# EAGLE design Accumulator Indicator Light r2 (EAGLE 7.2.0)
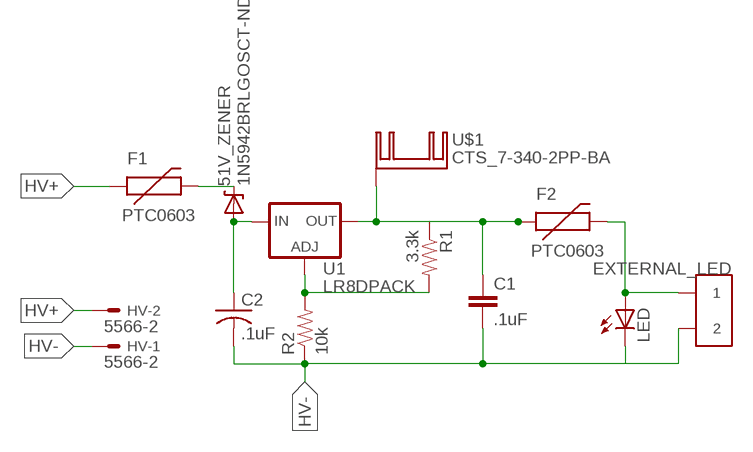
[diagram p0: schematic, sheet 1]

## Parts
51V_ZENER  1N5942BRLGOSCT-ND  DIODE-ZENERPTH  [DIODE-ZENER]
C1  .1uF  CAP0603-CAP  [0603-CAP]
C2  .1uF  C-USC2220  [C2220]
EXTERNAL_LED  CONN_2  [CONNECTOR_2]
F1  PTC0603  [0603]
F2  PTC0603  [0603]
HV  5566-2  [5566-2]
LED  LEDSMT1206  [1206]
R1  3.3k  RESISTOR0603  [0603-RES]
R2  10k  RESISTOR0603  [0603-RES]
U1  LR8DPACK  [DPACK]
U$1  CTS_7-340-2PP-BA  [TO-200_DUAL]

## Nets
HV+: F1.1 HV.2
HV-: C1.2 C2.2 EXTERNAL_LED.3 EXTERNAL_LED.4 HV.1 LED.C R2.1
N$: 51V_ZENER.P$2(A) C2.1 U1.1(IN)
N$1: R1.2 R2.2 U1.3(ADJ)
N$2: C1.1 F2.1 R1.1 U1.4(OUT) U$1.P$1(K) U$1.P$2(K) U$1.P$3(K)
N$8: 51V_ZENER.P$1(C) F1.2
N$10: EXTERNAL_LED.1 EXTERNAL_LED.2 F2.2 LED.A

## Library data of the parts
51V_ZENER = SparkFun-DiscreteSemi:DIODE-ZENER: Zener Diode Production Part - 8199 3.4V Zener Voltage
C1 = SparkFun-Capacitors:CAP: Capacitor Standard 0603 ceramic capacitor, and 0.1" leaded capacitor.
C2 = resistor:C-US: CAPACITOR, American symbol
EXTERNAL_LED = formula electric:CONN_2
F1 F2 = SparkFun-PowerIC:PTC: Resettable Fuse PTC Resettable Fuse. Spark Fun Electronics SKU : COM-08357
HV = con-molex:5566-2: Mini FIT connector 2 pol Source: http://www.molex.com; OC_FARNELL: 1822072; OC_NEWARK: unknown
LED = led:LED: LED OSRAM: - CHIPLED LG R971, LG N971, LY N971, LG Q971, LY Q971, LO R971, LY R971 LH N974, LH R974 LS Q976, LO Q976, LY Q976 LO Q996 - Hyper CHIPLED LW Q18S LB Q993, LB Q99A, LB R99A - SideLED LS A670, LO A670, LY A670, LG A670, LP A670 LB A673, LV A673, LT A673, LW A673 LH A674 LY A675 LS A676, LA A676, LO A676, LY A676, LW A676 LS A679, LY A679, LG A679 - Hyper Micro SIDELED® LS Y876, LA Y876, LO Y876, LY Y876 LT Y87S - SmartLED LW L88C, LW L88S LB L89C, LB L89S, LG L890 LS L89K, LO L89K, LY L89K LS L896, LA L896, LO L896, LY L896 - TOPLED LS T670, LO T670, LY T670, LG T670, LP T670 LSG T670, LSP T670, LSY T670, LOP T670, LYG T670 LG T671, LOG T671, LSG T671 LB T673, LV T673, LT T673, LW T673 LH T674 LS T676, LA T676, LO T676, LY T676, LB T676, LH T676, LSB T676, LW T676 LB T67C, LV T67C, LT T67C, LS T67K, LO T67K, LY T67K, LW E67C LS E67B, LA E67B, LO E67B, LY E67B, LB E67C, LV E67C, LT E67C LW T67C LS T679, LY T679, LG T679 LS T770, LO T770, LY T770, LG T770, LP T770 LB T773, LV T773, LT T773, LW T773 LH T774 LS E675, LA E675, LY E675, LS T675 LS T776, LA T776, LO T776, LY T776, LB T776 LHGB T686 LT T68C, LB T68C - Hyper Mini TOPLED® LB M676 - Mini TOPLED Santana® LG M470 LS M47K, LO M47K, LY M47K Source: http://www.osram.convergy.de LUXEON: - LUMILED® LXK2-PW12-R00, LXK2-PW12-S00, LXK2-PW14-U00, LXK2-PW14-V00 LXK2-PM12-R00, LXK2-PM12-S00, LXK2-PM14-U00 LXK2-PE12-Q00, LXK2-PE12-R00, LXK2-PE12-S00, LXK2-PE14-T00, LXK2-PE14-U00 LXK2-PB12-K00, LXK2-PB12-L00, LXK2-PB12-M00, LXK2-PB14-N00, LXK2-PB14-P00, LXK2-PB14-Q00 LXK2-PR12-L00, LXK2-PR12-M00, LXK2-PR14-Q00, LXK2-PR14-R00 LXK2-PD12-Q00, LXK2-PD12-R00, LXK2-PD12-S00 LXK2-PH12-R00, LXK2-PH12-S00 LXK2-PL12-P00, LXK2-PL12-Q00, LXK2-PL12-R00 Source: www.luxeon.com KINGBRIGHT: KA-3528ASYC Source: www.kingbright.com
R1 R2 = SparkFun-Resistors:RESISTOR: Resistor Basic schematic elements and footprints for 0603, 1206, and PTH resistors.
U1 = microchip:LR8: Digi-Key Part No.: LR8K4-GCT-ND
U$1 = heatsink:CTS_7-340-2PP-BA: Digikey Part No.: 294-1080-ND

## Board
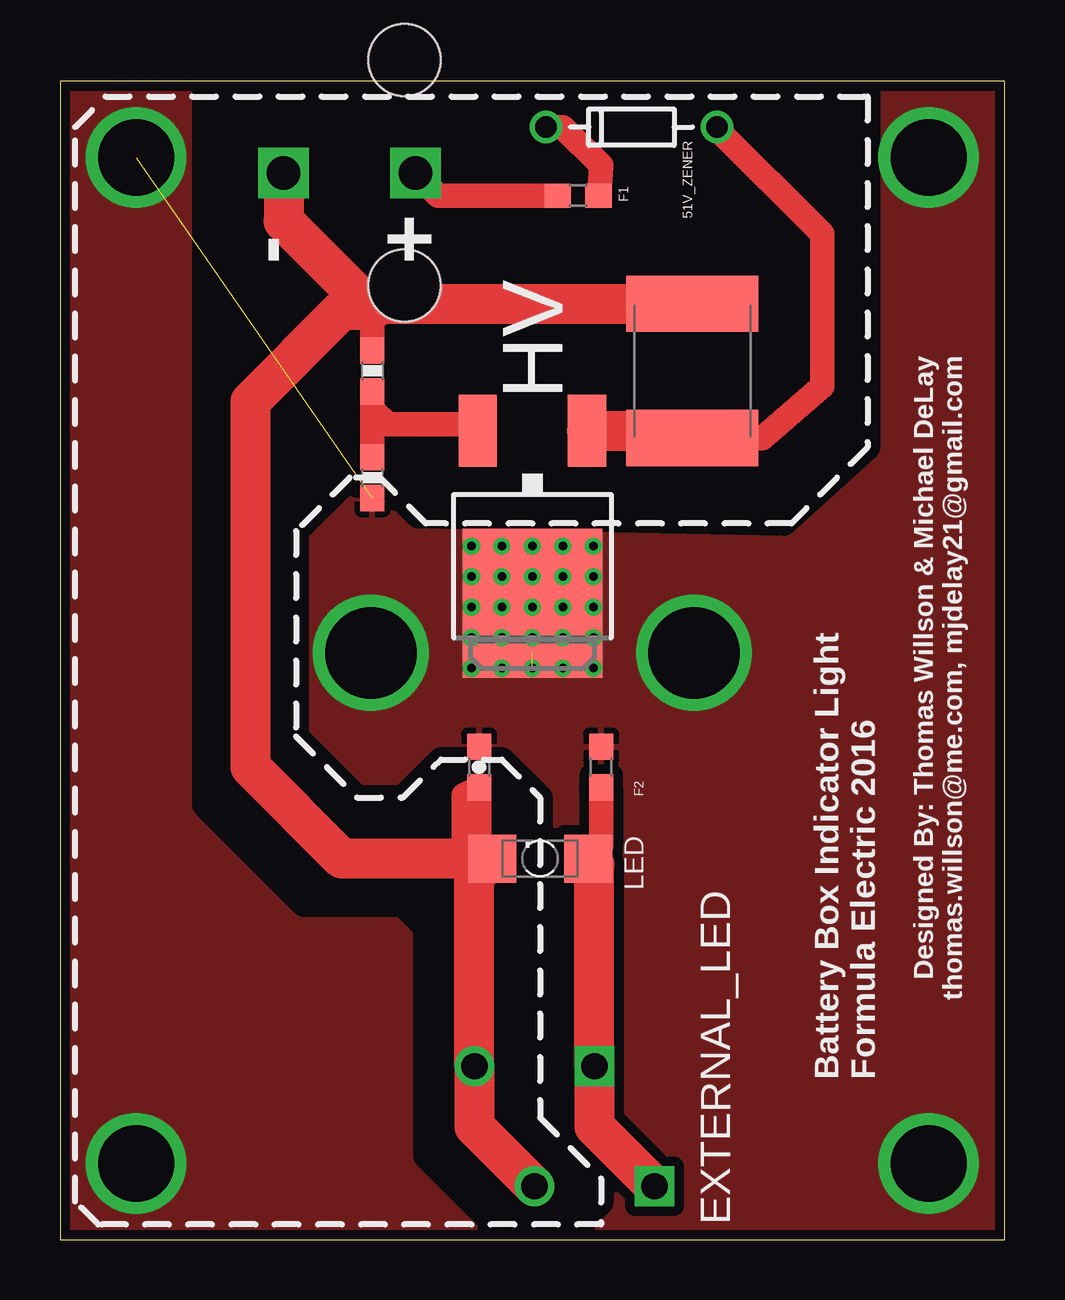
[diagram p1: board, top side]
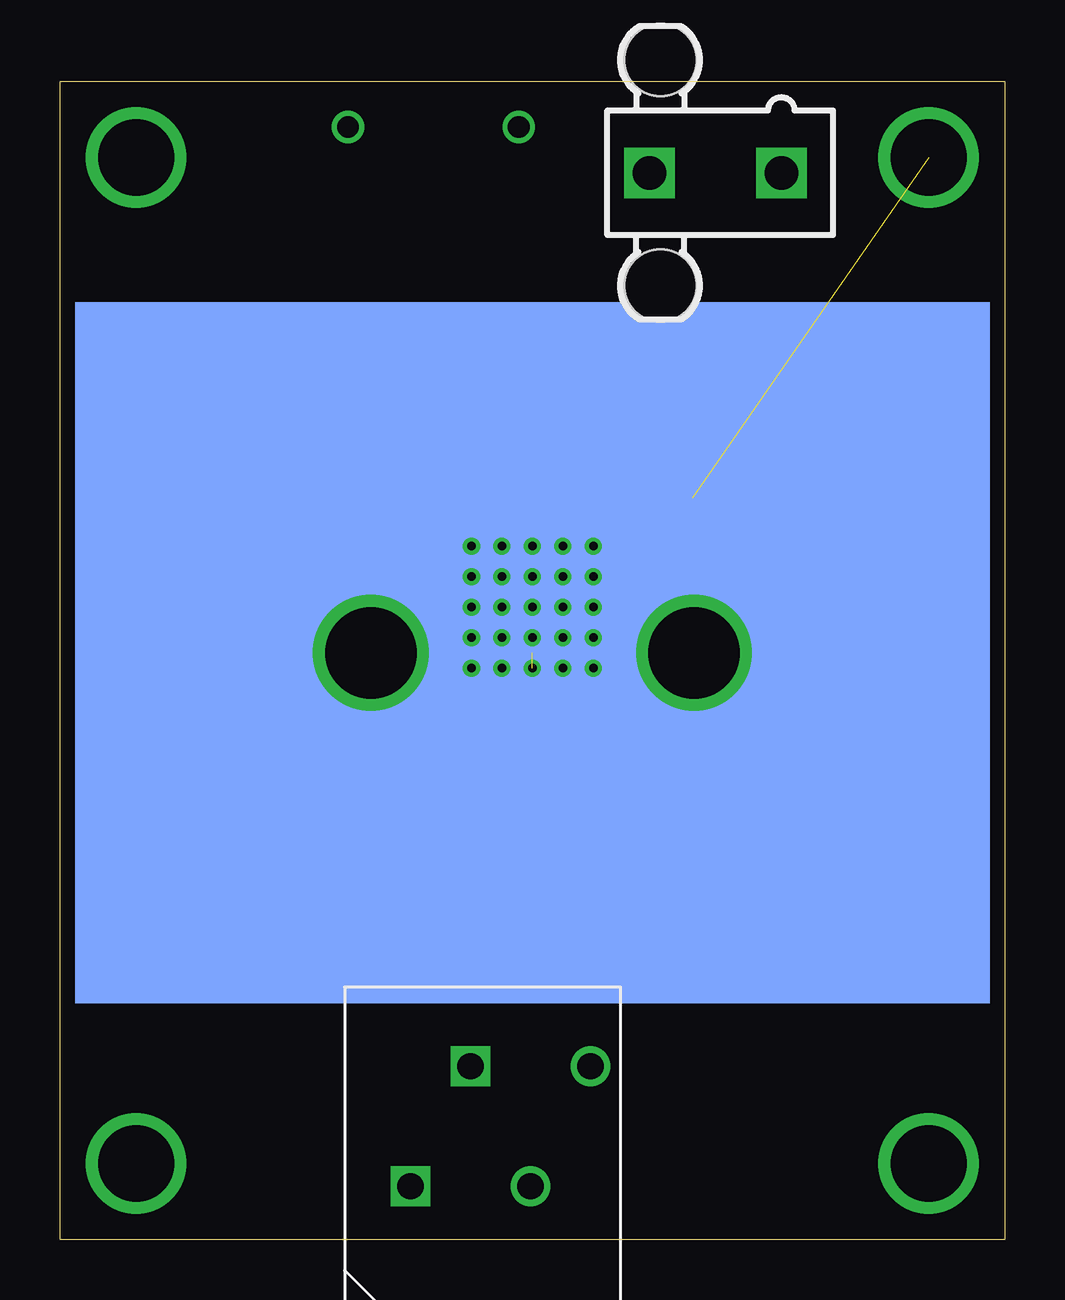
[diagram p2: board, bottom side, seen from below]

Size 39.37 x 48.26 mm. Coordinates in mm from the lower left corner, seen from the top.
Outline: 0,0 39.37,0 39.37,48.26 0,48.26 0,0
Copper layers (1*16): Top 0.0356mm / dielectric 1.5011mm / Bottom 0.0356mm
Design rules "OshPark DRC": minimum track width 6mil, minimum drill 13mil, track to track 6mil, track to pad 6mil, pad to pad 6mil, via to via 6mil, smd to smd 6mil, copper to edge 15mil, drill to drill 6mil, minimum pad ring 7mil, minimum via ring 7mil, stop-mask expansion 3mil, vias tented up to drill 0mil, thermal gap 10mil
tRestrict: area 6,29.8 to 33.7,47.9; area 6,0.3 to 22.5,36.8

### Footprints (pad centres in the part's own frame; a part is rotated, then mirrored left to right if it is on the bottom)
DIODE-ZENER = drill 0.9: P$1 -3.556,0; P$2 3.556,0
0603-CAP = smd 1.1 x 1: 1 -0.85,0; 2 0.85,0
C2220 = smd 2.35 x 5.5: 1 -2.8,0; 2 2.8,0
CONNECTOR_2 = drill 1.1 square: 1 0,0; 2 2.5,5 | drill 1.1: 3 5,0; 4 7.5,5
0603 = smd 1.1 x 1: 1 -0.85,0; 2 0.85,0
5566-2 = drill 1.4 square: 1 0,-2.75; 2 0,2.75 | hole 3: 4.7,2.29; -4.7,2.29
1206 = smd 2 x 2: A -2,0; C 2,0
0603-RES = smd 1.1 x 1: 1 -0.85,0; 2 0.85,0
DPACK = smd 1.6 x 3: 1 -2.28,-4.8; 3 2.28,-4.8 | smd 5.8 x 6.2: 4 0,2.38
TO-200_DUAL = smd 38.1 x 29.21: P$1 0,0 | drill 3.81: P$2 -6.731,0; P$3 6.731,0

### Placement (x,y rotation side)
51V_ZENER  23.81,46.35 0 top
C1  17.46,19.68 270 top
C2  26.35,36.2 90 top
EXTERNAL_LED  24.77,2.22 0 bottom
F1  21.59,43.5 0 top
F2  22.54,19.68 270 top
HV  12.06,44.45 90 bottom
LED  20,15.88 180 top
R1  13.02,31.75 90 top
R2  13.02,36.2 270 top
U1  19.68,28.89 180 top
U$1  19.68,24.45 180 bottom

### Tracks (layer width: path | path; a pad name or v marks a point on that pad's centre or on a via)
HV+
  Top 1.016: F1.1 15.77,43.5 HV.2
HV-
  Top 1.016: R2.1 13.02,38.73 13.02,39.37 13.39,38.99 | LED.C 17.46,16.41 C1.2 16.83,18.52 16.83,15.88 16.83,15.56
  Top 1.676: EXTERNAL_LED.3 17.27,4.72 EXTERNAL_LED.4 17.27,15.14 LED.C | 16.83,15.88 11.75,15.88 7.94,19.68 7.94,34.92 11.75,38.73 13.02,38.73 9.31,42.44 HV.1 | 13.39,38.99 C2.2
N$
  Top 1.016: C2.1 29.27,33.4 31.75,35.56 31.75,41.91 27.3,46.35 51V_ZENER.P$2
  Top 1.676: U1.1 27.01,33.69 C2.1
N$1
  Top 1.016: R1.2 R2.2 13.02,34.61 13.65,33.97 17.12,33.97 U1.3
N$2  (via drill 0.36, 3.17)  (2 unrouted)
  other vias: 17.14,28.89 18.41,28.89 19.68,28.89 20.95,28.89 22.23,28.89 22.23,27.62 20.95,27.62 19.68,27.62 18.41,27.62 17.14,27.62 17.14,26.35 18.41,26.35 19.68,26.35 20.95,26.35 22.23,26.35 22.23,25.08 20.95,25.08 19.68,25.08 18.41,25.08 17.14,25.08 17.14,23.81 18.41,23.81 19.68,23.81 20.95,23.81 22.23,23.81 3.17,45.09 3.17,3.17 36.2,3.17 36.2,45.09
  pour Top (isolate 0.406): 0,47.94 0,0 39.37,0 39.37,47.94
N$8
  Top 1.016: 51V_ZENER.P$1 20.95,46.35 22.54,44.77 22.48,43.54 F1.2
N$10
  Top 1.016: F2.2 22.54,16.41 LED.A
  Top 1.676: EXTERNAL_LED.1 22.27,4.72 EXTERNAL_LED.2 22.27,15.61 LED.A

### Text on the board
tNames: - | + | Designed By: Thomas Willson & Michael DeLay / thomas.willson@me.com, mjdelay21@gmail.com | Battery Box Indicator Light / Formula Electric 2016